# Altium schematic sheet LED.SchDoc: Persistence of Vision
size A4; Author: Nyiri Levente; Organization: BME_AUT; DocumentNumber: 3; Revision: 29; SheetNumber: 3; SheetTotal: 3
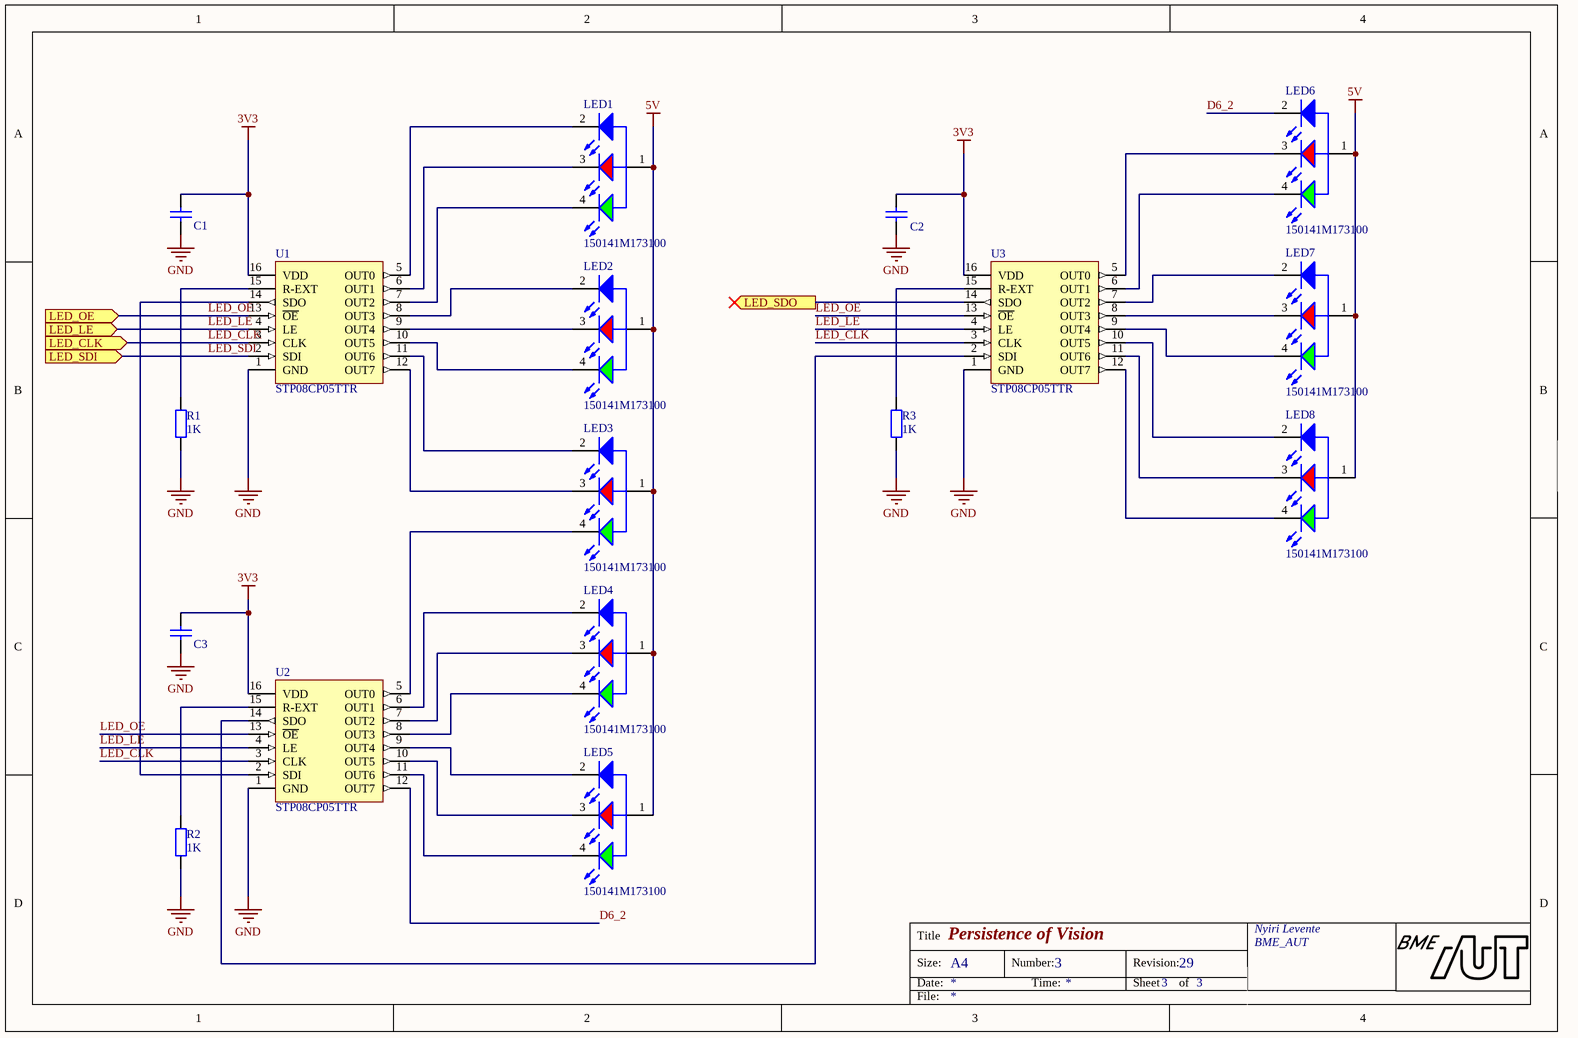
[diagram p0: LED.SchDoc]

## Parts
C1  100nF  [FP_0805_CAP_085]  (value not drawn)
C2  100nF  [FP_0805_CAP_085]  (value not drawn)
C3  100nF  [FP_0805_CAP_085]  (value not drawn)
LED1  150141M173100  [150141M173100]
LED2  150141M173100  [150141M173100]
LED3  150141M173100  [150141M173100]
LED4  150141M173100  [150141M173100]
LED5  150141M173100  [150141M173100]
LED6  150141M173100  [150141M173100]
LED7  150141M173100  [150141M173100]
LED8  150141M173100  [150141M173100]
R1  1K  [FP_0805_RES]
R2  1K  [FP_0805_RES]
R3  1K  [FP_0805_RES]
U1  STP08CP05TTR  [TSOP65P640X120-16M]
U2  STP08CP05TTR  [TSOP65P640X120-16M]
U3  STP08CP05TTR  [TSOP65P640X120-16M]

## Ports
LED_CLK (in), LED_LE (in), LED_OE (in), LED_SDI (in), LED_SDO (out)

## Nets
3V3: C1.2 C2.2 C3.2 U1.16(VDD) U2.16(VDD) U3.16(VDD)
5V: LED1.1(A) LED2.1(A) LED3.1(A) LED4.1(A) LED5.1(A) LED6.1(A) LED7.1(A) LED8.1(A)
GND: C1.1 C2.1 C3.1 R1.1 R2.1 R3.1 U1.1(GND) U2.1(GND) U3.1(GND)
D6_2: LED6.2(K) U2.12(OUT7)
LED_CLK: U1.3(CLK) U2.3(CLK) U3.3(CLK) ; port LED_CLK
LED_LE: U1.4(LE) U2.4(LE) U3.4(LE) ; port LED_LE
LED_OE: U1.13(~{OE}) U2.13(~{OE}) U3.13(~{OE}) ; port LED_OE
LED_SDI: U1.2(SDI) ; port LED_SDI
LED_SDO: U3.14(SDO) ; port LED_SDO
NetLED1_2: LED1.2(K) U1.5(OUT0)
NetLED1_3: LED1.3(K) U1.6(OUT1)
NetLED1_4: LED1.4(K) U1.7(OUT2)
NetLED2_2: LED2.2(K) U1.8(OUT3)
NetLED2_3: LED2.3(K) U1.9(OUT4)
NetLED2_4: LED2.4(K) U1.10(OUT5)
NetLED3_2: LED3.2(K) U1.11(OUT6)
NetLED3_3: LED3.3(K) U1.12(OUT7)
NetLED3_4: LED3.4(K) U2.5(OUT0)
NetLED4_2: LED4.2(K) U2.6(OUT1)
NetLED4_3: LED4.3(K) U2.7(OUT2)
NetLED4_4: LED4.4(K) U2.8(OUT3)
NetLED5_2: LED5.2(K) U2.9(OUT4)
NetLED5_3: LED5.3(K) U2.10(OUT5)
NetLED5_4: LED5.4(K) U2.11(OUT6)
NetLED6_3: LED6.3(K) U3.5(OUT0)
NetLED6_4: LED6.4(K) U3.6(OUT1)
NetLED7_2: LED7.2(K) U3.7(OUT2)
NetLED7_3: LED7.3(K) U3.8(OUT3)
NetLED7_4: LED7.4(K) U3.9(OUT4)
NetLED8_2: LED8.2(K) U3.10(OUT5)
NetLED8_3: LED8.3(K) U3.11(OUT6)
NetLED8_4: LED8.4(K) U3.12(OUT7)
NetR1_2: R1.2 U1.15(R-EXT)
NetR2_2: R2.2 U2.15(R-EXT)
NetR3_2: R3.2 U3.15(R-EXT)
NetU1_14: U1.14(SDO) U2.2(SDI)
NetU2_14: U2.14(SDO) U3.2(SDI)

## Notes on the sheet
- Title
- Size:
- Date:
- A4
- Number:
- Time:
- Revision:
- Sheet
- of
- File:

## Library data of the parts
C1-C3 = CAP: Capacitor; Name: 0805B104K500NT; Supplier: Lomex; Reference: 82-13-46
LED1-LED8 = 150141M173100: LED; Name: FYLS-3528RGBC-CA; Supplier: Lomex; Reference: 95-03-52
R1-R3 = RES: Resistor; Name: CR-05JL7; Supplier: Lomex; Reference: 81-10-87
U1-U3 = STP08CP05TTR: Low voltage, low current power 8-bit shift register; Reference: Tanszék; Supplier: ST; Name: STP08CP05TTR